# Altium project GNSS-Antenna.PrjPcb
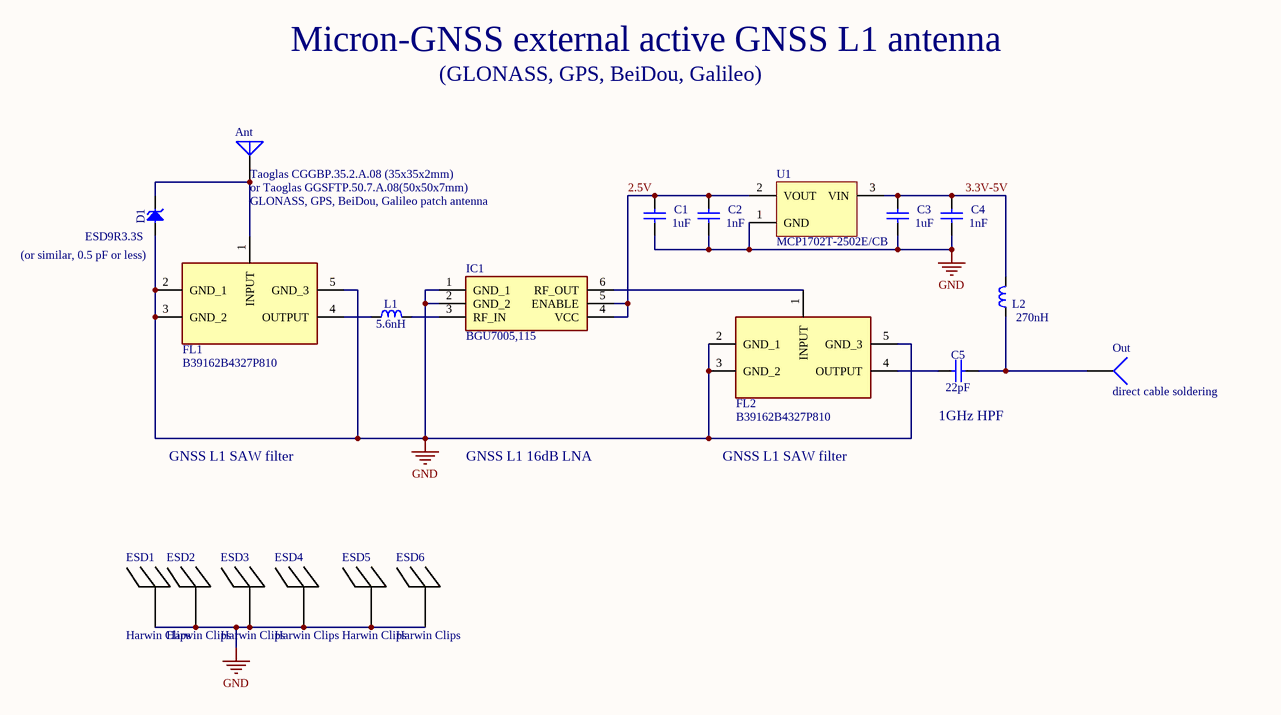
[diagram p0: AntennaSchematic.SchDoc]
1 sheet, 20 parts. Net scope: global (net labels, ports and power ports of the same name join across sheets).
Board file: AntennaPCB.PcbDoc

## Sheet AntennaSchematic.SchDoc
size A4; SheetNumber: 1; SheetTotal: 1

### Parts
Ant  Taoglas CGGBP.35.2.A.08 (35x35x2mm)  [PIN1]
C1  1uF  [CAPC1005X55N]
C2  1nF  [CAPC1005X55N]
C3  1uF  [CAPC1005X55N]
C4  1nF  [CAPC1005X55N]
C5  22pF  [CAPC1005X55N]
D1  ESD9R3.3S  [SOD2512X110N]
ESD1  Harwin Clips  [HARWIN - S0981-46R - CLIP]
ESD2  Harwin Clips  [HARWIN - S0981-46R - CLIP]
ESD3  Harwin Clips  [HARWIN - S0981-46R - CLIP]
ESD4  Harwin Clips  [HARWIN - S0981-46R - CLIP]
ESD5  Harwin Clips  [HARWIN - S0991-46R - CLIP]
ESD6  Harwin Clips  [HARWIN - S0991-46R - CLIP]
FL1  B39162B4327P810  [B39921B4344P810]
FL2  B39162B4327P810  [B39921B4344P810]
IC1  BGU7005,115  [SL3S1013FTB0115]
L1  5.6nH  [INDC1005X55N]
L2  270nH  [INDC1005X55N]
Out  direct cable soldering  [PIN1]
U1  MCP1702T-2502E/CB  [SOT-23A-CB3_N]

### Nets
GND: C1.1 C2.1 C3.1 C4.1 D1.2(A) ESD1.1 ESD2.1 ESD3.1 ESD4.1 ESD5.1 ESD6.1 FL1.2(GND_1) FL1.3(GND_2) FL1.5(GND_3) FL2.2(GND_1) FL2.3(GND_2) FL2.5(GND_3) IC1.1(GND_1) IC1.2(GND_2) U1.1(GND)
2.5V: C1.2 C2.2 IC1.4(VCC) IC1.5(ENABLE) U1.2(VOUT)
3.3V-5V: C3.2 C4.2 L2.2 U1.3(VIN)
NetAnt_1: Ant.1(A) D1.1(C) FL1.1(INPUT)
NetC5_1: C5.1 FL2.4(OUTPUT)
NetC5_2: C5.2 L2.1 Out.1
NetFL1_4: FL1.4(OUTPUT) L1.1
NetFL2_1: FL2.1(INPUT) IC1.6(RF_OUT)
NetIC1_3: IC1.3(RF_IN) L1.2

### Notes on the sheet
- Micron-GNSS external active GNSS L1 antenna
- (GLONASS, GPS, BeiDou, Galileo)
- (near Ant) or Taoglas GGSFTP.50.7.A.08(50x50x7mm)
- GLONASS, GPS, BeiDou, Galileo patch antenna
- (near FL1) (or similar, 0.5 pF or less)
- (near C5) 1GHz HPF
- GNSS L1 SAW filter
- GNSS L1 16dB LNA

### Library data of the parts
Ant = Antenna: Generic Antenna; Published: 24-Mar-1999; LatestRevisionDate: 17-Jul-2002; LatestRevisionNote: Re-released for DXP Platform.; PackageReference: PIN1; Publisher: Altium Limited
C1-C5 = CC0402_10NF_50V_10%_X7R: Non-polarised capacitor; Part Description: SMD Multilayer Chip Ceramic Capacitor; Manufacturer: GENERIC; Manufacturer1 Part Number: GRM155R71H103KA88D; Voltage: 50V; TC: X7R; Tolerance: ±10%; Part Number: CC0402_10NF_50V_10%_X7R; Component Kind: Standard; Component Type: Standard; Pin Count: 2; Status: None; Manufacturer Part Number: CC0402_10NF_50V_10%_X7R; Case: 0402; Mounted: Yes; Socket: No; SMD: Yes; Sense: No; Manufacturer1 Example: MURATA; Manufacturer1 ComponentHeight: 0.55mm; HelpURL: \\cern.ch\dfs\Applications\Altium\Datasheets\CC0402_X7R_MURATA_GRM.pdf; Author: CERN DEM MR; CreateDate: 08.01.2016; LatestRevisionDate: 08.01.2016
  C1 C3: Value: 1uF
  C2 C4: Value: 1nF
  C5: Value: 22pF
D1 = PESD5V0S1UA: Transient Voltage Suppressor Diode (Uni-Directional); Part Description: Unidirectional ESD Protection for Transient Voltage Suppression; Manufacturer: NXP SEMICONDUCTORS; Voltage: 5V; Power: 890W; PressFit: No; Bonding: No; Part Number: PESD5V0S1UA; Component Kind: Standard; Component Type: Standard; Device: ESD9R3.3S; PackageDescription: Small Outline Diode Flat Lead (SOD-323), 1.70mm W X 1.25mm L X 1.10mm H body,  IPC Medium Density; Manufacturer Part Number: PESD5V0S1UA; Pin Count: 2; Case: SOD323; Mounted: Yes; Socket: No; SMD: Yes; Sense: No; ComponentHeight: 1.1mm; HelpURL: \\cern.ch\dfs\Applications\Altium\Datasheets\PESD5V0S1UA.pdf; Author: CERN DEM JLC; CreateDate: 28.08.2012; LatestRevisionDate: 18.09.2013
ESD1-ESD6 = Harwin Clips: Order: S0981-46R
FL1 FL2 = B39162B4327P810: Filter; Manufacturer_Name: TDK; Datasheet Link: https://static6.arrow.com/aropdfconversion/457160cdcba5f1770f035cca3bb9ee2755d7a371/171b4327.pdf; Manufacturer_Part_Number: B39162B4327P810; Mouser Part Number: N/A; Mouser Price/Stock: https://www.mouser.co.uk/ProductDetail/TDK/B39162B4327P810?qs=hUXy7GzqLWzEDXeMvC1aGg%3D%3D
IC1 = BGU7005,115: Integrated Circuit; Manufacturer_Name: NXP; Datasheet Link: http://www.nxp.com/docs/en/data-sheet/BGU7005.pdf; Height: 0.5mm; Manufacturer_Part_Number: BGU7005,115; Mouser Part Number: 771-BGU7005115; Mouser Price/Stock: https://www.mouser.co.uk/ProductDetail/NXP-Semiconductors/BGU7005115?qs=2NzsBjR%252BRRlSWzh3ohfbQQ%3D%3D; Arrow Part Number: BGU7005,115; Arrow Price/Stock: https://www.arrow.com/en/products/bgu7005115/nxp-semiconductors
L1 L2 = IND0402_MURATA_BLM15HD601SN1: Inductor; Part Description: SMD EMIFIL Suppression Chip Ferrite Bead; Manufacturer: MURATA; Manufacturer Part Number: BLM15HD601SN1D; Power: 300mA; Resistance: 0.85R; Tolerance: ±25%; Part Number: IND0402_MURATA_BLM15HD601SN1; Component Kind: Standard; Component Type: Standard; Pin Count: 2; Status: None; Case: 0402; Mounted: Yes; Socket: No; SMD: Yes; Sense: No; ComponentHeight: 0.55mm; HelpURL: \\cern.ch\dfs\Applications\Altium\Datasheets\IND0402_MURATA_BLM15H.pdf; Author: CERN DEM JLC; CreateDate: 28.02.2012; LatestRevisionDate: 28.02.2012
  L1: Value: 5.6nH
  L2: Value: 270nH
Out = Socket: LatestRevisionDate: 17-Jul-2002; LatestRevisionNote: Re-released for DXP Platform.; Publisher: Altium Limited
U1 = MCP1702T-2502E/CB: 250 mA Low Quiescent Current LDO Regulator, 3-Pin SOT-23A, Extended Temperature, Tape and Reel; Published: 29-Jan-2009; LatestRevisionDate: 02-Dec-2009; LatestRevisionNote: Updated to datasheet revision D, Jun-2009; DatasheetVersion: revD, Jun-2009; PackageVersion: revBB, Aug-2009; PackageReference: SOT-23A-CB3; Publisher: Altium Limited; PackageDescription: 3-Lead Plastic Small Outline Transistor (CB) [SOT-23A]; Supplier 1: Digi-Key; Supplier Part Number 1: MCP1702T-2502E/CBTR-ND; Supplier 2: Digi-Key; Supplier Part Number 2: MCP1702T-2502E/CBCT-ND; Supplier 3: Digi-Key; Supplier Part Number 3: MCP1702T-2502E/CBDKR-ND; Supplier 4: Farnell; Supplier Part Number 4: 1627173; ComponentLink1Description: Datasheet; ComponentLink1URL: http://ww1.microchip.com/downloads/en/DeviceDoc/22008d.pdf; ComponentLink2Description: Packaging Specification; ComponentLink2URL: http://www.microchip.com/stellent/groups/techpub_sg/documents/packagingspec/en012702.pdf; ComponentLink3Description: Microchip.com Home; ComponentLink3URL: http://www.microchip.com/